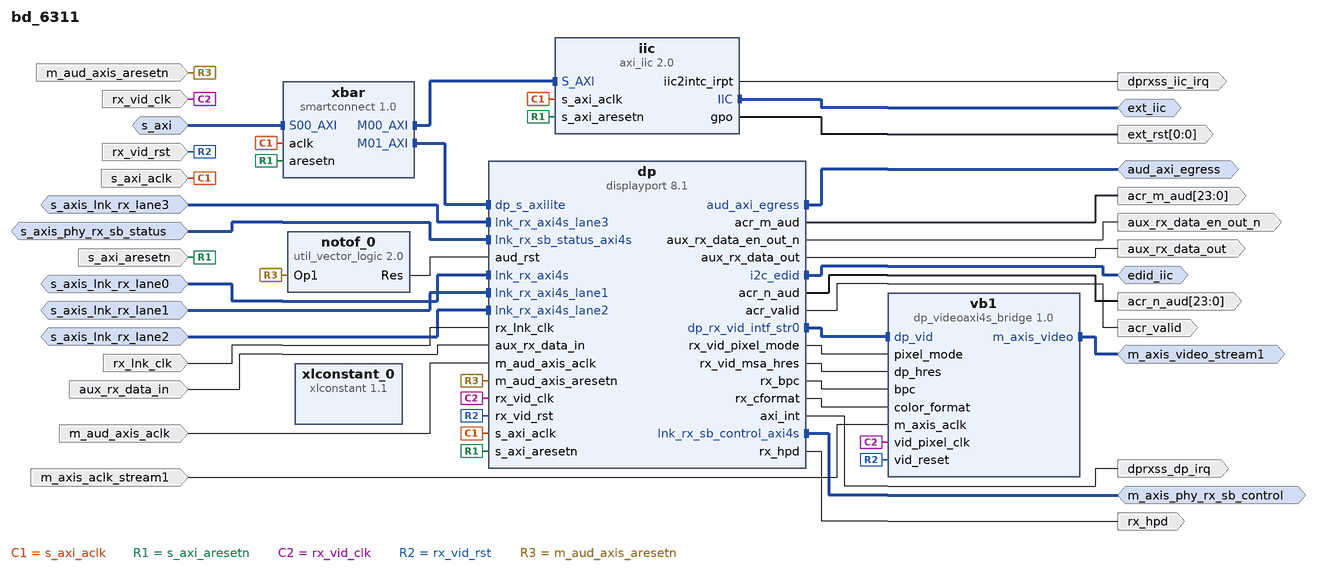
[diagram p0: block diagram of the top level]
# Vivado block design bd_6311, xczu9eg-ffvb1156-2-e, Vivado 2020.1
create_bd_design bd_6311

create_bd_intf_port -mode Slave -vlnv xilinx.com:interface:aximm_rtl:1.0 s_axi
set_property -dict [list \
  CONFIG.DATA_WIDTH 32 \
  CONFIG.PROTOCOL AXI4LITE \
  CONFIG.ADDR_WIDTH 13 \
  CONFIG.NUM_READ_OUTSTANDING 8 \
  CONFIG.NUM_WRITE_OUTSTANDING 8 \
  CONFIG.master_id 0 \
] [get_bd_intf_ports s_axi]
create_bd_intf_port -mode Slave -vlnv xilinx.com:interface:axis_rtl:1.0 s_axis_phy_rx_sb_status
create_bd_intf_port -mode Master -vlnv xilinx.com:interface:axis_rtl:1.0 m_axis_phy_rx_sb_control
create_bd_intf_port -mode Slave -vlnv xilinx.com:interface:axis_rtl:1.0 s_axis_lnk_rx_lane0
create_bd_intf_port -mode Slave -vlnv xilinx.com:interface:axis_rtl:1.0 s_axis_lnk_rx_lane1
create_bd_intf_port -mode Slave -vlnv xilinx.com:interface:axis_rtl:1.0 s_axis_lnk_rx_lane2
create_bd_intf_port -mode Slave -vlnv xilinx.com:interface:axis_rtl:1.0 s_axis_lnk_rx_lane3
create_bd_intf_port -mode Master -vlnv xilinx.com:interface:iic_rtl:1.0 edid_iic
create_bd_intf_port -mode Master -vlnv xilinx.com:interface:axis_rtl:1.0 aud_axi_egress
set_property -dict {CONFIG.HAS_TKEEP 0 CONFIG.HAS_TLAST 0} [get_bd_intf_ports aud_axi_egress]
create_bd_intf_port -mode Master -vlnv xilinx.com:interface:axis_rtl:1.0 m_axis_video_stream1
set_property -dict {CONFIG.HAS_TKEEP 0} [get_bd_intf_ports m_axis_video_stream1]
create_bd_intf_port -mode Master -vlnv xilinx.com:interface:iic_rtl:1.0 ext_iic
create_bd_port -dir I -type clk s_axi_aclk
set_property -dict [list \
  CONFIG.ASSOCIATED_BUSIF m_axis_phy_rx_sb_control:s_axi:s_axis_phy_rx_sb_status \
  CONFIG.ASSOCIATED_RESET s_axi_aresetn \
] [get_bd_ports s_axi_aclk]
create_bd_port -dir I -type rst s_axi_aresetn
set_property -dict {CONFIG.POLARITY ACTIVE_LOW} [get_bd_ports s_axi_aresetn]
create_bd_port -dir I -type clk rx_vid_clk
set_property -dict {CONFIG.ASSOCIATED_RESET rx_vid_rst} [get_bd_ports rx_vid_clk]
create_bd_port -dir I -type rst rx_vid_rst
set_property -dict {CONFIG.POLARITY ACTIVE_HIGH} [get_bd_ports rx_vid_rst]
create_bd_port -dir I -type clk m_axis_aclk_stream1
create_bd_port -dir I aux_rx_data_in
create_bd_port -dir O aux_rx_data_out
create_bd_port -dir O aux_rx_data_en_out_n
create_bd_port -dir I -type clk rx_lnk_clk
set_property -dict [list \
  CONFIG.ASSOCIATED_BUSIF s_axis_lnk_rx_lane0:s_axis_lnk_rx_lane1:s_axis_lnk_rx_lane2:s_axis_lnk_rx_lane3 \
] [get_bd_ports rx_lnk_clk]
create_bd_port -dir O -type data rx_hpd
create_bd_port -dir O -type intr dprxss_dp_irq
create_bd_port -dir I -type clk m_aud_axis_aclk
set_property -dict [list \
  CONFIG.ASSOCIATED_BUSIF aud_axi_egress \
  CONFIG.ASSOCIATED_RESET m_aud_axis_aresetn \
] [get_bd_ports m_aud_axis_aclk]
create_bd_port -dir I -type rst m_aud_axis_aresetn
set_property -dict {CONFIG.POLARITY ACTIVE_LOW} [get_bd_ports m_aud_axis_aresetn]
create_bd_port -dir O -from 23 -to 0 acr_m_aud
create_bd_port -dir O -from 23 -to 0 acr_n_aud
create_bd_port -dir O -type data acr_valid
create_bd_port -dir O -from 0 -to 0 ext_rst
create_bd_port -dir O -type intr dprxss_iic_irq

create_bd_cell -type ip -vlnv xilinx.com:ip:displayport:8.1 dp
set_property -dict [list \
  CONFIG.C_VERSAL false \
  CONFIG.Data_flow_direction Receive_Sink_Core \
  CONFIG.Enable_HDCP22_Encryption_Hooks false \
  CONFIG.Enable_HDCP_Encryption_Hooks false \
  CONFIG.Enable_of_Audio_Channels true \
  CONFIG.GT_Data_Width 2 \
  CONFIG.Link_Rate 8.1 \
  CONFIG.MST_Enable false \
  CONFIG.Max_Bits_Per_Color 10 \
  CONFIG.Number_of_Audio_Channels 2 \
  CONFIG.Number_of_Lanes 4 \
  CONFIG.PHY_type_External External_phy \
  CONFIG.Protocol_Selection DP_1_3 \
  CONFIG.Quad_Pixel_Enable true \
  CONFIG.SIM_Mode false \
  CONFIG.SS_Mode true \
  CONFIG.YCRCB_Enable true \
  CONFIG.YOnly_Enable true \
  CONFIG.aux_io_loc 1 \
  CONFIG.aux_io_type 0 \
  CONFIG.eDP_Enable false \
] [get_bd_cells dp]
create_bd_cell -type ip -vlnv xilinx.com:ip:xlconstant:1.1 xlconstant_0
set_property -dict {CONFIG.CONST_VAL 0} [get_bd_cells xlconstant_0]
create_bd_cell -type ip -vlnv xilinx.com:ip:axi_iic:2.0 iic
set_property -dict {CONFIG.IIC_FREQ_KHZ 400} [get_bd_cells iic]
create_bd_cell -type ip -vlnv xilinx.com:ip:smartconnect:1.0 xbar
set_property -dict {CONFIG.NUM_MI 2 CONFIG.NUM_SI 1} [get_bd_cells xbar]
create_bd_cell -type ip -vlnv xilinx.com:ip:dp_videoaxi4s_bridge:1.0 vb1
set_property -dict [list \
  CONFIG.C_MAX_BPC 10 \
  CONFIG.C_M_AXIS_VIDEO_TDATA_WIDTH 120 \
  CONFIG.C_PPC 4 \
  CONFIG.C_UG934_COMPLIANCE true \
] [get_bd_cells vb1]
create_bd_cell -type ip -vlnv xilinx.com:ip:util_vector_logic:2.0 notof_0
set_property -dict {CONFIG.C_OPERATION not CONFIG.C_SIZE 1} [get_bd_cells notof_0]

# ---- connections ----

connect_bd_intf_net [get_bd_intf_ports s_axi] [get_bd_intf_pins xbar/S00_AXI]
connect_bd_intf_net [get_bd_intf_pins xbar/M01_AXI] [get_bd_intf_pins dp/dp_s_axilite]
connect_bd_intf_net [get_bd_intf_pins xbar/M00_AXI] [get_bd_intf_pins iic/S_AXI]
connect_bd_intf_net [get_bd_intf_ports edid_iic] [get_bd_intf_pins dp/i2c_edid]
connect_bd_intf_net [get_bd_intf_ports m_axis_phy_rx_sb_control] [get_bd_intf_pins dp/lnk_rx_sb_control_axi4s]
connect_bd_intf_net [get_bd_intf_pins dp/dp_rx_vid_intf_str0] [get_bd_intf_pins vb1/dp_vid]
connect_bd_intf_net [get_bd_intf_ports aud_axi_egress] [get_bd_intf_pins dp/aud_axi_egress]
connect_bd_intf_net [get_bd_intf_ports m_axis_video_stream1] [get_bd_intf_pins vb1/m_axis_video]
connect_bd_intf_net -intf_net s_axis_lnk_rx_lane3_1 [get_bd_intf_ports s_axis_lnk_rx_lane3] [get_bd_intf_pins dp/lnk_rx_axi4s_lane3]
connect_bd_intf_net [get_bd_intf_ports ext_iic] [get_bd_intf_pins iic/IIC]
connect_bd_intf_net [get_bd_intf_ports s_axis_phy_rx_sb_status] [get_bd_intf_pins dp/lnk_rx_sb_status_axi4s]
connect_bd_intf_net -intf_net s_axis_lnk_rx_lane0_1 [get_bd_intf_ports s_axis_lnk_rx_lane0] [get_bd_intf_pins dp/lnk_rx_axi4s]
connect_bd_intf_net -intf_net s_axis_lnk_rx_lane1_1 [get_bd_intf_ports s_axis_lnk_rx_lane1] [get_bd_intf_pins dp/lnk_rx_axi4s_lane1]
connect_bd_intf_net -intf_net s_axis_lnk_rx_lane2_1 [get_bd_intf_ports s_axis_lnk_rx_lane2] [get_bd_intf_pins dp/lnk_rx_axi4s_lane2]
connect_bd_net [get_bd_ports s_axi_aclk] [get_bd_pins dp/s_axi_aclk] [get_bd_pins iic/s_axi_aclk] [get_bd_pins xbar/aclk]
connect_bd_net [get_bd_ports s_axi_aresetn] [get_bd_pins dp/s_axi_aresetn] [get_bd_pins iic/s_axi_aresetn] [get_bd_pins xbar/aresetn]
connect_bd_net [get_bd_ports rx_vid_clk] [get_bd_pins dp/rx_vid_clk] [get_bd_pins vb1/vid_pixel_clk]
connect_bd_net [get_bd_ports rx_vid_rst] [get_bd_pins dp/rx_vid_rst] [get_bd_pins vb1/vid_reset]
connect_bd_net -net m_axis_aclk_stream1_1 [get_bd_ports m_axis_aclk_stream1] [get_bd_pins vb1/m_axis_aclk]
connect_bd_net [get_bd_ports rx_lnk_clk] [get_bd_pins dp/rx_lnk_clk]
connect_bd_net [get_bd_ports aux_rx_data_in] [get_bd_pins dp/aux_rx_data_in]
connect_bd_net [get_bd_pins dp/aux_rx_data_out] [get_bd_ports aux_rx_data_out]
connect_bd_net [get_bd_pins dp/aux_rx_data_en_out_n] [get_bd_ports aux_rx_data_en_out_n]
connect_bd_net [get_bd_pins dp/axi_int] [get_bd_ports dprxss_dp_irq]
connect_bd_net [get_bd_pins dp/rx_hpd] [get_bd_ports rx_hpd]
connect_bd_net [get_bd_pins dp/rx_vid_pixel_mode] [get_bd_pins vb1/pixel_mode]
connect_bd_net [get_bd_pins dp/rx_vid_msa_hres] [get_bd_pins vb1/dp_hres]
connect_bd_net [get_bd_pins dp/rx_bpc] [get_bd_pins vb1/bpc]
connect_bd_net [get_bd_pins dp/rx_cformat] [get_bd_pins vb1/color_format]
connect_bd_net [get_bd_pins iic/gpo] [get_bd_ports ext_rst]
connect_bd_net [get_bd_pins iic/iic2intc_irpt] [get_bd_ports dprxss_iic_irq]
connect_bd_net [get_bd_ports m_aud_axis_aclk] [get_bd_pins dp/m_aud_axis_aclk]
connect_bd_net [get_bd_ports m_aud_axis_aresetn] [get_bd_pins dp/m_aud_axis_aresetn] [get_bd_pins notof_0/Op1]
connect_bd_net [get_bd_pins notof_0/Res] [get_bd_pins dp/aud_rst]
connect_bd_net [get_bd_pins dp/acr_m_aud] [get_bd_ports acr_m_aud]
connect_bd_net [get_bd_pins dp/acr_n_aud] [get_bd_ports acr_n_aud]
connect_bd_net [get_bd_pins dp/acr_valid] [get_bd_ports acr_valid]

# ---- address map ----
assign_bd_address -offset 0x0000 -range 4K -target_address_space [get_bd_addr_spaces s_axi] [get_bd_addr_segs dp/dp_s_axilite/Reg]
assign_bd_address -offset 0x1000 -range 4K -target_address_space [get_bd_addr_spaces s_axi] [get_bd_addr_segs iic/S_AXI/Reg]

validate_bd_design
save_bd_design
